# EAGLE design TransientsControls (EAGLE 9.6.2)
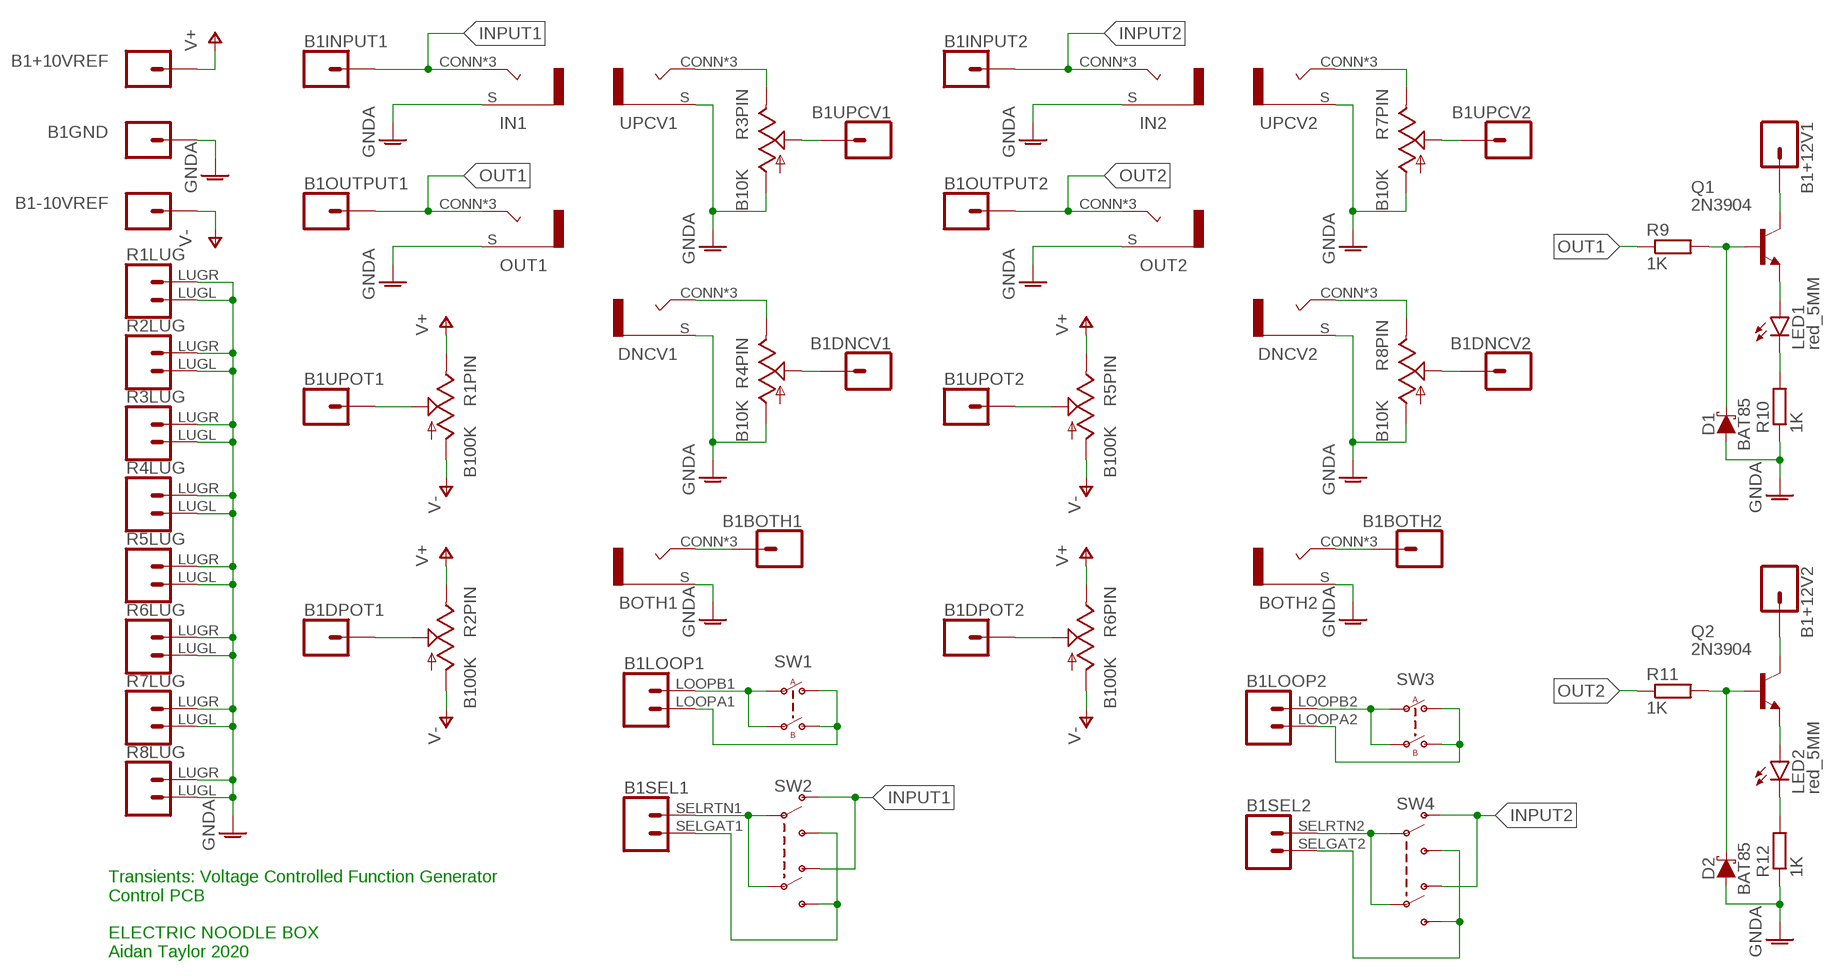
[diagram p0: schematic, sheet 1]

## Parts
B1  TRANSIENTS_LINK  [TRANSIENTS]
BOTH1  COMBI-JACKCINCHNANA  [NEWCOMBOJACK_PANEL]
BOTH2  COMBI-JACKCINCHNANA  [NEWCOMBOJACK_PANEL]
D1  BAT85  SCHOTTKY_DO35  [DO35-7]
D2  BAT85  SCHOTTKY_DO35  [DO35-7]
DNCV1  COMBI-JACKCINCHNANA  [NEWCOMBOJACK_PANEL]
DNCV2  COMBI-JACKCINCHNANA  [NEWCOMBOJACK_PANEL]
IN1  COMBI-JACKCINCHNANA  [NEWCOMBOJACK_PANEL]
IN2  COMBI-JACKCINCHNANA  [NEWCOMBOJACK_PANEL]
LED1  red_5MM  LED5MM  [LED5MM]
LED2  red_5MM  LED5MM  [LED5MM]
OUT1  COMBI-JACKCINCHNANA  [NEWCOMBOJACK_PANEL]
OUT2  COMBI-JACKCINCHNANA  [NEWCOMBOJACK_PANEL]
Q1  2N3904  [TO92]
Q2  2N3904  [TO92]
R1  B100K  POTENTIOMETER  [ALPHA_RV09_9MMPOT]
R2  B100K  POTENTIOMETER  [ALPHA_RV09_9MMPOT]
R3  B10K  POTENTIOMETER  [ALPHA_RV09_9MMPOT]
R4  B10K  POTENTIOMETER  [ALPHA_RV09_9MMPOT]
R5  B100K  POTENTIOMETER  [ALPHA_RV09_9MMPOT]
R6  B100K  POTENTIOMETER  [ALPHA_RV09_9MMPOT]
R7  B10K  POTENTIOMETER  [ALPHA_RV09_9MMPOT]
R8  B10K  POTENTIOMETER  [ALPHA_RV09_9MMPOT]
R9  1K  R-EU_0207/10  [0207/10]
R10  1K  R-EU_0207/10  [0207/10]
R11  1K  R-EU_0207/10  [0207/10]
R12  1K  R-EU_0207/10  [0207/10]
SW1  PVA1_DPST  [PVA1_PUSHBUTTON]
SW2  PVA2_DPDT  [PVA2_PUSHBUTTON]
SW3  PVA1_DPST  [PVA1_PUSHBUTTON]
SW4  PVA2_DPDT  [PVA2_PUSHBUTTON]
UPCV1  COMBI-JACKCINCHNANA  [NEWCOMBOJACK_PANEL]
UPCV2  COMBI-JACKCINCHNANA  [NEWCOMBOJACK_PANEL]

## Nets
GNDA: B1.GND1 B1.GND2 BOTH1.S BOTH2.S D1.A D2.A DNCV1.S DNCV2.S IN1.S IN2.S OUT1.S OUT2.S R1.LUGL R1.LUGR R2.LUGL R2.LUGR R3.C1(PIN:A) R3.LUGL R3.LUGR R4.C1(PIN:A) R4.LUGL R4.LUGR R5.LUGL R5.LUGR R6.LUGL R6.LUGR R7.C1(PIN:A) R7.LUGL R7.LUGR R8.C1(PIN:A) R8.LUGL R8.LUGR R10.1 R12.1 UPCV1.S UPCV2.S
INPUT1: B1.IN1 IN1.CONN(T) IN1.T1(T) IN1.T2(T) SW2.SWA2(SW1_3) SW2.SWB2(SW2_3)
INPUT2: B1.INPUT2 IN2.CONN(T) IN2.T1(T) IN2.T2(T) SW4.SWA2(SW1_3) SW4.SWB2(SW2_3)
N$1: B1.+12V1 Q1.1(C)
N$2: B1.UPOT1 R1.C2(PIN:W)
N$3: B1.DPOT1 R2.C2(PIN:W)
N$4: DNCV1.CONN(T) DNCV1.T1(T) DNCV1.T2(T) R4.C3(PIN:B)
N$5: R3.C3(PIN:B) UPCV1.CONN(T) UPCV1.T1(T) UPCV1.T2(T)
N$6: B1.UPCV1 R3.C2(PIN:W)
N$7: B1.BOTH1 BOTH1.CONN(T) BOTH1.T1(T) BOTH1.T2(T)
N$8: B1.DNCV1 R4.C2(PIN:W)
N$10: B1.UPOT2 R5.C2(PIN:W)
N$11: B1.DPOT2 R6.C2(PIN:W)
N$12: B1.LOOPB1 SW1.SWA1 SW1.SWB1
N$13: B1.LOOPA1 SW1.SWA2 SW1.SWB2
N$14: B1.SELGAT1 SW2.SWA1(SW1_1) SW2.SWB1(SW2_1)
N$15: B1.SELRTN1 SW2.SWA0(SW1_2) SW2.SWB0(SW2_2)
N$16: R7.C3(PIN:B) UPCV2.CONN(T) UPCV2.T1(T) UPCV2.T2(T)
N$17: B1.UPCV2 R7.C2(PIN:W)
N$18: DNCV2.CONN(T) DNCV2.T1(T) DNCV2.T2(T) R8.C3(PIN:B)
N$19: B1.DNCV2 R8.C2(PIN:W)
N$20: B1.BOTH2 BOTH2.CONN(T) BOTH2.T1(T) BOTH2.T2(T)
N$21: B1.LOOPB2 SW3.SWA1 SW3.SWB1
N$22: B1.LOOPA2 SW3.SWA2 SW3.SWB2
N$23: B1.SELGAT2 SW4.SWA1(SW1_1) SW4.SWB1(SW2_1)
N$24: B1.SELRTN2 SW4.SWA0(SW1_2) SW4.SWB0(SW2_2)
N$25: D1.C Q1.2(B) R9.2
N$26: LED1.A Q1.3(E)
N$27: LED1.K(C) R10.2
N$28: D2.C Q2.2(B) R11.2
N$29: LED2.A Q2.3(E)
N$30: LED2.K(C) R12.2
N$31: B1.+12V2 Q2.1(C)
OUT1: B1.OUT1 OUT1.CONN(T) OUT1.T1(T) OUT1.T2(T) R9.1
OUT2: B1.OUT2 OUT2.CONN(T) OUT2.T1(T) OUT2.T2(T) R11.1
V+: B1.+10VR1 B1.+10VR2 R1.C3(PIN:B) R2.C3(PIN:B) R5.C3(PIN:B) R6.C3(PIN:B)
V-: B1.-10VR1 B1.-10VR2 R1.C1(PIN:A) R2.C1(PIN:A) R5.C1(PIN:A) R6.C1(PIN:A)
Unconnected: B1.DSHP1 B1.DSHP2

## Notes on the sheet
- Transients: Voltage Controlled Function Generator
  Control PCB
  
  ELECTRIC NOODLE BOX
  Aidan Taylor 2020

## Library data of the parts
B1 = ElectricNoodleBox:TRANSIENTS_LINK
BOTH1 BOTH2 DNCV1 DNCV2 IN1 IN2 OUT1 OUT2 UPCV1 UPCV2 = ElectricNoodleBox:COMBI-JACK
D1 D2 = ElectricNoodleBox:SCHOTTKY_DO35
LED1 LED2 = led:LED: LED OSRAM: - CHIPLED LG R971, LG N971, LY N971, LG Q971, LY Q971, LO R971, LY R971 LH N974, LH R974 LS Q976, LO Q976, LY Q976 LO Q996 - Hyper CHIPLED LW Q18S LB Q993, LB Q99A, LB R99A - SideLED LS A670, LO A670, LY A670, LG A670, LP A670 LB A673, LV A673, LT A673, LW A673 LH A674 LY A675 LS A676, LA A676, LO A676, LY A676, LW A676 LS A679, LY A679, LG A679 - Hyper Micro SIDELED® LS Y876, LA Y876, LO Y876, LY Y876 LT Y87S - SmartLED LW L88C, LW L88S LB L89C, LB L89S, LG L890 LS L89K, LO L89K, LY L89K LS L896, LA L896, LO L896, LY L896 - TOPLED LS T670, LO T670, LY T670, LG T670, LP T670 LSG T670, LSP T670, LSY T670, LOP T670, LYG T670 LG T671, LOG T671, LSG T671 LB T673, LV T673, LT T673, LW T673 LH T674 LS T676, LA T676, LO T676, LY T676, LB T676, LH T676, LSB T676, LW T676 LB T67C, LV T67C, LT T67C, LS T67K, LO T67K, LY T67K, LW E67C LS E67B, LA E67B, LO E67B, LY E67B, LB E67C, LV E67C, LT E67C LW T67C LS T679, LY T679, LG T679 LS T770, LO T770, LY T770, LG T770, LP T770 LB T773, LV T773, LT T773, LW T773 LH T774 LS E675, LA E675, LY E675, LS T675 LS T776, LA T776, LO T776, LY T776, LB T776 LHGB T686 LT T68C, LB T68C - Hyper Mini TOPLED® LB M676 - Mini TOPLED Santana® LG M470 LS M47K, LO M47K, LY M47K Source: http://www.osram.convergy.de LUXEON: - LUMILED® LXK2-PW12-R00, LXK2-PW12-S00, LXK2-PW14-U00, LXK2-PW14-V00 LXK2-PM12-R00, LXK2-PM12-S00, LXK2-PM14-U00 LXK2-PE12-Q00, LXK2-PE12-R00, LXK2-PE12-S00, LXK2-PE14-T00, LXK2-PE14-U00 LXK2-PB12-K00, LXK2-PB12-L00, LXK2-PB12-M00, LXK2-PB14-N00, LXK2-PB14-P00, LXK2-PB14-Q00 LXK2-PR12-L00, LXK2-PR12-M00, LXK2-PR14-Q00, LXK2-PR14-R00 LXK2-PD12-Q00, LXK2-PD12-R00, LXK2-PD12-S00 LXK2-PH12-R00, LXK2-PH12-S00 LXK2-PL12-P00, LXK2-PL12-Q00, LXK2-PL12-R00 Source: www.luxeon.com KINGBRIGHT: KA-3528ASYC Source: www.kingbright.com
Q1 Q2 = transistor-neu-to92:2N3904: NPN TRANSISTOR
R1-R8 = ElectricNoodleBox:POTENTIOMETER
R9-R12 = rcl:R-EU_: RESISTOR, European symbol; SPICEPREFIX: R
SW1 SW3 = ElectricNoodleBox:PVA1_DPST
SW2 SW4 = ElectricNoodleBox:PVA2_DPDT

## Board
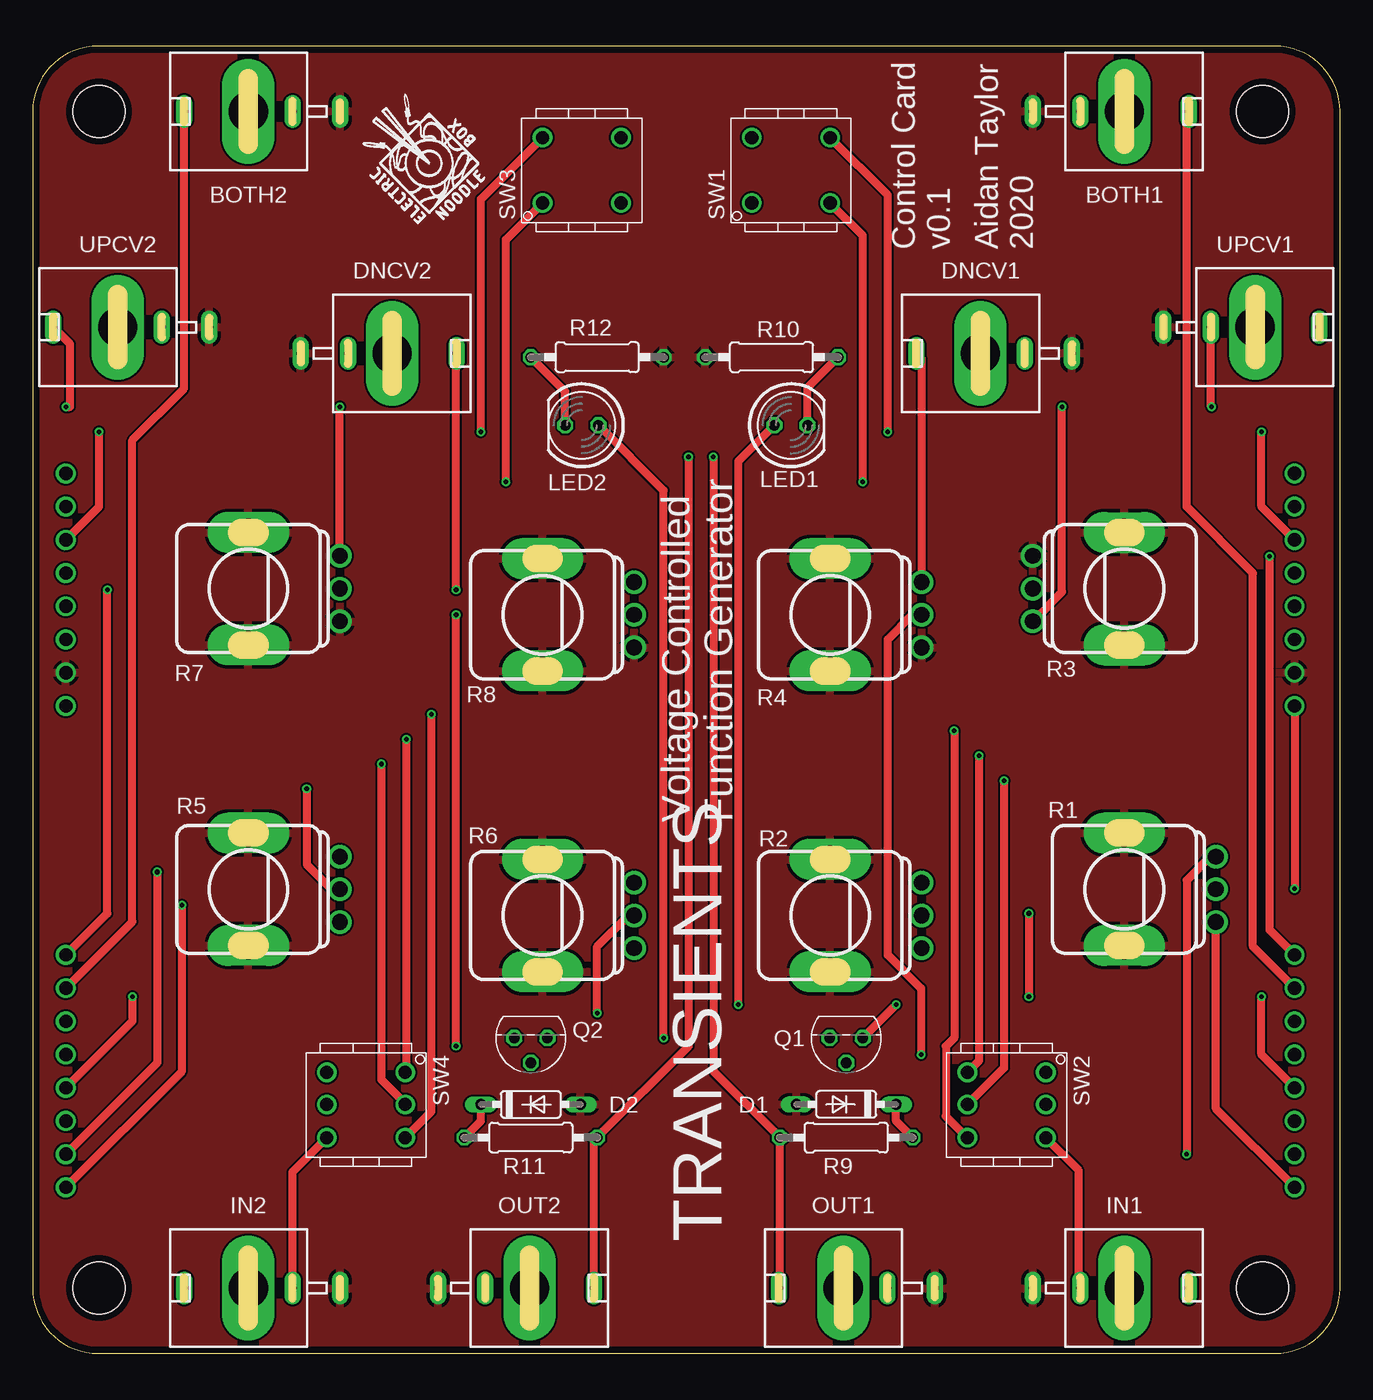
[diagram p1: board, top side]
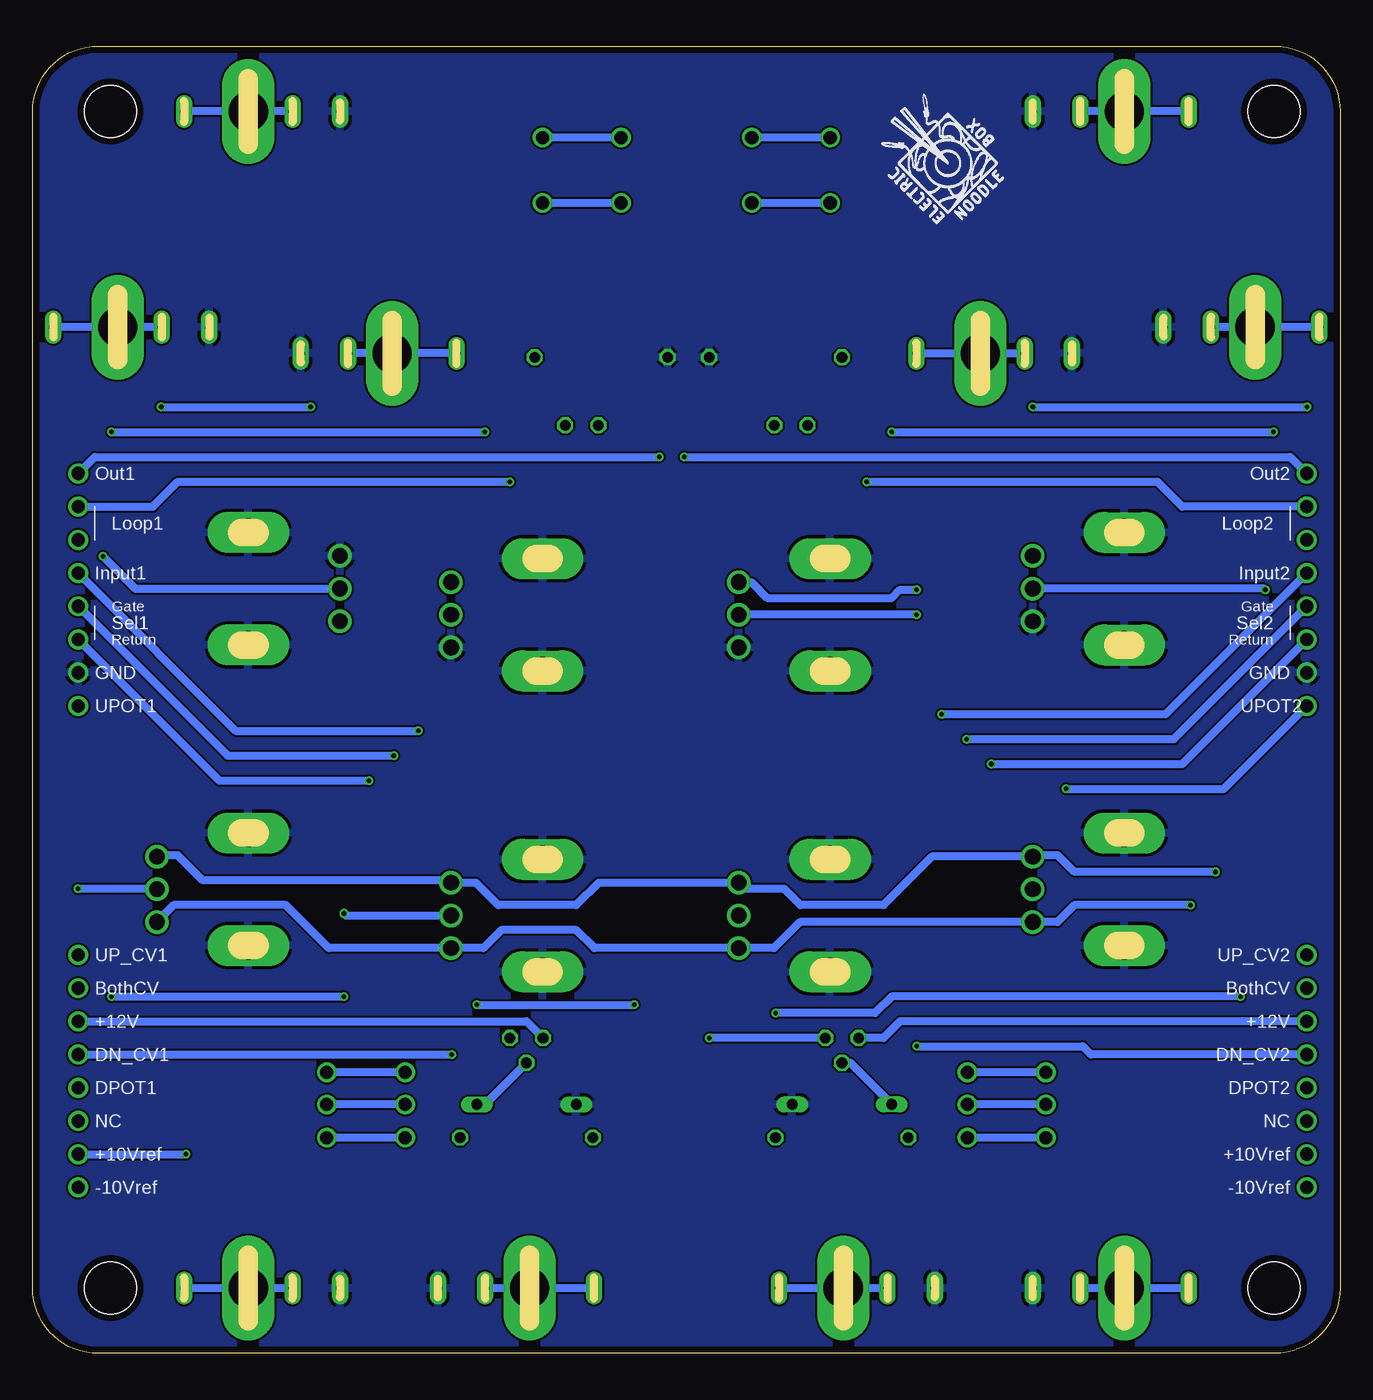
[diagram p2: board, bottom side, seen from below]

Size 100 x 100 mm. Coordinates in mm from the lower left corner, seen from the top.
Outline: 0,95 0,5 arc90 5,0 95,0 arc90 100,5 100,95 arc90 95,100 5,100 arc90 0,95
Copper layers (1*16): Top 0.035mm / dielectric 1.6mm / Bottom 0.035mm
Design rules "Elecrow_2-layer_PCB_eagle_rule": minimum track width 6mil, minimum drill 12mil, track to track 6mil, track to pad 6mil, pad to pad 6mil, via to via 8mil, smd to smd 0mil, copper to edge 20mil, drill to drill 10mil, minimum pad ring 6mil, minimum via ring 6mil, stop-mask expansion 0mil, vias tented up to drill 100mil, thermal gap 10mil

### Footprints (pad centres in the part's own frame; a part is rotated, then mirrored left to right if it is on the bottom)
TRANSIENTS = drill 1.016: +10VR1 2.54,15.24; +10VR2 96.52,15.24; +12V1 2.54,25.4; +12V2 96.52,25.4; -10VR1 2.54,12.7; -10VR2 96.52,12.7; BOTH1 2.54,27.94; BOTH2 96.52,27.94; DNCV1 2.54,22.86; DNCV2 96.52,22.86; DPOT1 2.54,20.32; DPOT2 96.52,20.32; DSHP1 2.54,17.78; DSHP2 96.52,17.78; GND1 2.54,52.07; GND2 96.52,52.07; IN1 2.54,59.69; INPUT2 96.52,59.69; LOOPA1 2.54,62.23; LOOPA2 96.52,62.23; LOOPB1 2.54,64.77; LOOPB2 96.52,64.77; OUT1 2.54,67.31; OUT2 96.52,67.31; SELGAT1 2.54,57.15; SELGAT2 96.52,57.15; SELRTN1 2.54,54.61; SELRTN2 96.52,54.61; UPCV1 2.54,30.48; UPCV2 96.52,30.48; UPOT1 2.54,49.53; UPOT2 96.52,49.53 | hole 4: 5,5; 94,5; 94,95; 5,95
NEWCOMBOJACK_PANEL = drill 3 pad 3.6 long: CONN 0,0 | drill 0.6 pad 1.27 long: S 0,-7; T1 0,4.92; T2 0,-3.38
DO35-7 = drill 0.813 long: A 3.81,0; C -3.81,0
LED5MM = drill 0.813 octagon: A -1.27,0; K 1.27,0
TO92 = drill 0.813 octagon: 1 1.27,0; 2 0,1.905; 3 -1.27,0
ALPHA_RV09_9MMPOT = drill 1.2 pad 1.778: C1 -2.5,-7; C2 0,-7; C3 2.5,-7 | drill 2.1 pad 2.8 long: LUGL -4.3,0; LUGR 4.3,0
0207/10 = drill 0.813 octagon: 1 -5.08,0; 2 5.08,0
PVA1_PUSHBUTTON = drill 1: SWA1 -3,-2.5; SWA2 -3,2.5; SWB1 3,-2.5; SWB2 3,2.5
PVA2_PUSHBUTTON = drill 1: SWA0 -3,-0.04; SWA1 -3,-2.5; SWA2 -3,2.5; SWB0 3,-0.04; SWB1 3,-2.5; SWB2 3,2.5

### Placement (x,y rotation side)
B1  99.06,0 0 bottom
BOTH1  83.5,95 270 top
BOTH2  16.5,95 90 top
D1  62.23,19.05 180 top
D2  38.1,19.05 0 top
DNCV1  72.5,76.5 90 top
DNCV2  27.5,76.5 270 top
IN1  83.5,5 270 top
IN2  16.5,5 90 top
LED1  58,71 0 top
LED2  42,71 180 top
OUT1  62,5 90 top
OUT2  38,5 270 top
Q1  62.23,24.13 180 top
Q2  38.1,24.13 180 top
R1  83.5,35.5 90 top
R2  61,33.5 90 top
R3  83.5,58.5 270 top
R4  61,56.5 90 top
R5  16.5,35.5 90 top
R6  39,33.5 90 top
R7  16.5,58.5 90 top
R8  39,56.5 90 top
R9  62.23,16.51 0 top
R10  56.52,76.2 0 top
R11  38.1,16.51 180 top
R12  43.18,76.2 180 top
SW1  58,90.5 0 top
SW2  74.5,19 180 top
SW3  42,90.5 0 top
SW4  25.5,19 180 top
U$1  [LOGO10X10]  34.92,86.36 90 top
U$2  [LOGO10X10]  25.4,86.36 90 bottom
UPCV1  93.5,78.5 270 top
UPCV2  6.5,78.5 90 top

### Tracks (layer width: path | path; a pad name or v marks a point on that pad's centre or on a via)
GNDA
  pour Bottom: 0,0 100.33,0 100.33,99.69 0.64,99.69 0,99.69
  pour Top: 0,0 100.33,0 100.33,100.33 0,100.33
INPUT1  (via drill 0.35)
  Top 0.61: v70.48,47.62 70.48,24.13 69.85,23.5 69.85,18.15 SW2.SWB2 | IN1.T2 80.01,5.11 80.01,13.99 SW2.SWA2
  Bottom 0.61: B1.IN1 84.45,47.62 v70.48,47.62 | IN1.T2 IN1.CONN IN1.T1 | SW2.SWB2 SW2.SWA2
INPUT2  (via drill 0.35)
  Top 0.61: v30.48,48.9 30.48,18.48 SW4.SWA2 | IN2.T2 19.88,13.88 SW4.SWB2
  Bottom 0.61: B1.INPUT2 13.34,48.9 v30.48,48.9 | IN2.T1 IN2.CONN IN2.T2 | SW4.SWB2 SW4.SWA2
N$1
  Bottom 0.61: B1.+12V1 62.23,25.4 Q1.1
N$2  (via drill 0.35)
  Top 0.61: B1.UPOT1 v96.52,35.56
  Bottom 0.61: v96.52,35.56 90.56,35.56 R1.C2
N$3  (via drill 0.35)
  Top 0.61: B1.DPOT1 93.98,22.86 v93.98,27.3 | v76.2,33.66 v76.2,27.3
  Bottom 0.61: v93.98,27.3 v76.2,27.3 | v76.2,33.66 76.05,33.5 R2.C2
N$4
  Top 0.61: R4.C3 68,76.08 DNCV1.T1
  Bottom 0.61: DNCV1.T1 DNCV1.CONN DNCV1.T2
N$5  (via drill 0.35)
  Top 0.61: R3.C3 78.74,58.24 v78.74,72.39 | v90.17,72.39 90.12,72.44 UPCV1.T2
  Bottom 0.61: v90.17,72.39 v78.74,72.39 | UPCV1.T2 UPCV1.CONN UPCV1.T1
N$6  (via drill 0.35)
  Top 0.61: B1.UPCV1 94.61,32.38 v94.61,60.96
  Bottom 0.61: v94.61,60.96 92.16,58.5 R3.C2
N$7
  Top 0.61: B1.BOTH1 93.34,31.11 93.34,59.69 88.27,64.77 88.27,94.84 BOTH1.T1
  Bottom 0.61: BOTH1.T2 BOTH1.CONN BOTH1.T1
N$8  (via drill 0.35)
  Top 0.61: R4.C2 67.98,56.52 67.31,56.52 65.41,54.61 65.41,30.48 67.94,27.94 v67.94,22.86
  Bottom 0.61: B1.DNCV1 v67.94,22.86
N$10  (via drill 0.35)
  Top 0.61: R5.C2 22.86,35.5 20.95,37.41 v20.95,43.18
  Bottom 0.61: B1.UPOT2 8.89,43.18 v20.95,43.18
N$11  (via drill 0.35)
  Top 0.61: v7.62,27.3 7.62,25.4 B1.DPOT2 | v43.18,26.04 43.18,31.11 45.56,33.5 R6.C2
  Bottom 0.61: v7.62,27.3 34.29,27.3 35.56,26.04 v43.18,26.04
N$12  (via drill 0.35)
  Top 0.61: SW1.SWB1 63.5,85.5 v63.5,66.67
  Bottom 0.61: B1.LOOPB1 90.81,64.77 88.9,66.67 v63.5,66.67 | SW1.SWA1 SW1.SWB1
N$13  (via drill 0.35)
  Top 0.61: B1.LOOPA1 93.98,64.77 v93.98,70.48 | v65.41,70.48 65.41,88.59 SW1.SWB2
  Bottom 0.61: v93.98,70.48 v65.41,70.48 | SW1.SWA2 SW1.SWB2
N$14  (via drill 0.35)
  Top 0.61: v72.39,45.72 72.39,22.39 SW2.SWB1
  Bottom 0.61: B1.SELGAT1 85.09,45.72 v72.39,45.72 | SW2.SWB1 SW2.SWA1
N$15  (via drill 0.35)
  Top 0.61: v74.3,43.81 74.3,21.84 SW2.SWB0
  Bottom 0.61: B1.SELRTN1 85.72,43.81 v74.3,43.81 | SW2.SWB0 SW2.SWA0
N$16  (via drill 0.35)
  Top 0.61: R7.C3 v23.5,72.39 | UPCV2.T1 2.85,77.23 2.85,72.39 v2.54,72.39
  Bottom 0.61: v23.5,72.39 v2.54,72.39 | UPCV2.T1 UPCV2.CONN UPCV2.T2
N$17  (via drill 0.35)
  Top 0.61: B1.UPCV2 5.71,33.66 v5.71,58.42
  Bottom 0.61: v5.71,58.42 5.79,58.5 R7.C2
N$18  (via drill 0.35)
  Top 0.61: v32.38,58.42 32.38,76.47 DNCV2.T1
  Bottom 0.61: R8.C3 45.03,59 43.81,57.78 34.29,57.78 33.66,58.42 v32.38,58.42 | DNCV2.T1 DNCV2.CONN DNCV2.T2
N$19  (via drill 0.35)
  Top 0.61: v32.38,23.5 v32.38,56.52
  Bottom 0.61: B1.DNCV2 19.05,22.86 19.68,23.5 v32.38,23.5 | v32.38,56.52 32.4,56.5 R8.C2
N$20
  Top 0.61: B1.BOTH2 7.62,33.02 7.62,69.85 11.58,73.81 BOTH2.T1
  Bottom 0.61: BOTH2.T1 BOTH2.CONN BOTH2.T2
N$21  (via drill 0.35)
  Top 0.61: v36.2,66.67 36.2,85.19 SW3.SWA1
  Bottom 0.61: v36.2,66.67 13.97,66.67 12.06,64.77 B1.LOOPB2 | SW3.SWA1 SW3.SWB1
N$22  (via drill 0.35)
  Top 0.61: B1.LOOPA2 5.08,64.77 v5.08,70.48 | v34.29,70.48 34.29,88.29 SW3.SWA2
  Bottom 0.61: v34.29,70.48 v5.08,70.48 | SW3.SWA2 SW3.SWB2
N$23  (via drill 0.35)
  Top 0.61: v28.57,46.99 28.57,21.57 SW4.SWA1
  Bottom 0.61: B1.SELGAT2 12.7,46.99 v28.57,46.99 | SW4.SWB1 SW4.SWA1
N$24  (via drill 0.35)
  Top 0.61: v26.67,45.09 26.67,20.95 28.5,19.12 SW4.SWA0
  Bottom 0.61: B1.SELRTN2 12.06,45.09 v26.67,45.09 | SW4.SWB0 SW4.SWA0
N$25
  Top 0.61: R9.2 66.04,17.78 D1.C
  Bottom 0.61: D1.C 65.41,19.05 Q1.2
N$26  (via drill 0.35)
  Top 0.61: Q1.3 v66.04,26.67 | v53.98,26.67 53.98,68.25 LED1.A
  Bottom 0.61: v66.04,26.67 v53.98,26.67
N$27
  Top 0.61: LED1.K 59.27,73.88 R10.2
N$28
  Top 0.61: R11.2 34.29,17.78 D2.C
  Bottom 0.61: D2.C 37.47,22.23 Q2.2
N$29  (via drill 0.35)
  Top 0.61: v48.26,24.13 48.26,66.01 LED2.A
  Bottom 0.61: Q2.3 v48.26,24.13
N$30
  Top 0.61: LED2.K 40.73,73.57 R12.2
N$31
  Bottom 0.61: Q2.1 34.92,24.13 33.66,25.4 B1.+12V2
OUT1  (via drill 0.35)
  Top 0.61: v52.07,68.58 52.07,21.59 R9.1 57.15,5.07 OUT1.T1
  Bottom 0.61: B1.OUT1 95.25,68.58 v52.07,68.58 | OUT1.T1 OUT1.CONN OUT1.T2
OUT2  (via drill 0.35)
  Top 0.61: v50.16,68.58 50.16,23.5 R11.1 42.92,16.25 OUT2.T1
  Bottom 0.61: B1.OUT2 3.81,68.58 v50.16,68.58 | OUT2.T2 OUT2.CONN OUT2.T1
V+  (via drill 0.35)
  Top 0.61: B1.+10VR2 9.53,22.23 v9.53,36.83 | v88.27,15.24 88.27,36.2 90.17,38.1 90.4,38.1 R1.C3
  Bottom 0.61: v9.53,36.83 20.32,36.83 21.59,38.1 23.4,38.1 R5.C3 31.21,38 34.92,34.29 41.27,34.29 42.55,35.56 45.56,35.56 R6.C3 56.71,36 58.42,34.29 64.39,34.29 66.09,36 R2.C3 68.19,36.2 87,36.2 88.9,38.1 90.4,38.1 R1.C3 | B1.+10VR1 v88.27,15.24
V-  (via drill 0.35)
  Top 0.61: B1.-10VR2 11.43,21.59 v11.43,34.29 | B1.-10VR1 90.5,18.72 R1.C1
  Bottom 0.61: v11.43,34.29 20.32,34.29 21.61,33 R5.C1 41.3,33 43.3,31 R6.C1 57.03,31 58.42,32.38 64.14,32.38 65.52,31 R2.C1 77.36,31 80.64,34.29 89.21,34.29 R1.C1

### Text on the board
tPlace: Control Card / v0.1 | Aidan Taylor / 2020 | Voltage Controlled / Function Generator | TRANSIENTS